# EAGLE design schematic (EAGLE 9.1.1)
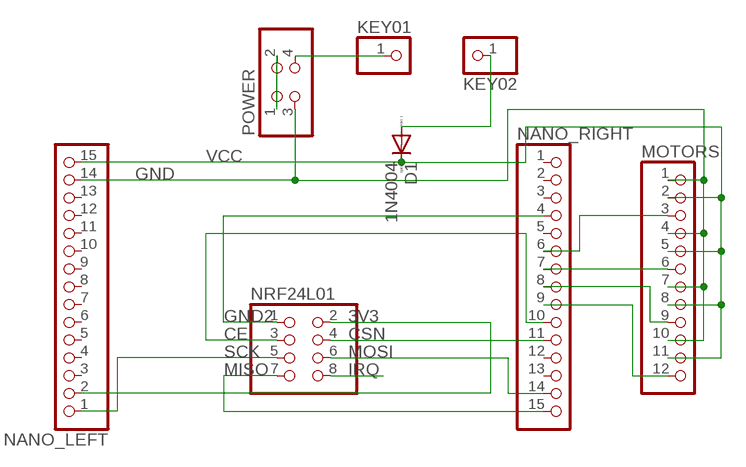
[diagram p0: schematic, sheet 1]

## Parts
D1  1N4004  [DO41-10]
KEY01  PINHD-1X1  [1X01]
KEY02  PINHD-1X1  [1X01]
MOTORS  PINHD-1X12  [1X12]
NANO_LEFT  PINHD-1X15  [1X15]
NANO_RIGHT  PINHD-1X15  [1X15]
NRF24L01  PINHD-2X4  [2X04]
POWER  PINHD-2X2  [2X02]

## Nets
3V3: NANO_LEFT.2 NRF24L01.2
CE: NANO_RIGHT.10 NRF24L01.3
CSN: NANO_RIGHT.11 NRF24L01.4
GND: MOTORS.1 MOTORS.4 MOTORS.7 MOTORS.10 NANO_LEFT.14 POWER.3
GND2: NANO_RIGHT.4 NRF24L01.1
IRQ: NRF24L01.8
MISO: NANO_RIGHT.15 NRF24L01.7
MOSI: NANO_RIGHT.14 NRF24L01.6
N$1: POWER.1 POWER.2
N$2: KEY01.1 POWER.4
N$3: D1.A KEY02.1
N$4: MOTORS.12 NANO_RIGHT.9
N$5: MOTORS.9 NANO_RIGHT.8
N$6: MOTORS.6 NANO_RIGHT.7
N$7: MOTORS.3 NANO_RIGHT.6
SCK: NANO_LEFT.1 NRF24L01.5
VCC: D1.C MOTORS.2 MOTORS.5 MOTORS.8 MOTORS.11 NANO_LEFT.15
Unconnected: NANO_LEFT.3 NANO_LEFT.4 NANO_LEFT.5 NANO_LEFT.6 NANO_LEFT.7 NANO_LEFT.8 NANO_LEFT.9 NANO_LEFT.10 NANO_LEFT.11 NANO_LEFT.12 NANO_LEFT.13 NANO_RIGHT.1 NANO_RIGHT.2 NANO_RIGHT.3 NANO_RIGHT.5 NANO_RIGHT.12 NANO_RIGHT.13

## Library data of the parts
D1 = diode:1N4004: DIODE general purpose rectifier, 1 A
KEY01 KEY02 = pinhead:PINHD-1X1: PIN HEADER
MOTORS = pinhead:PINHD-1X12: PIN HEADER
NANO_LEFT NANO_RIGHT = pinhead:PINHD-1X15: PIN HEADER
NRF24L01 = pinhead:PINHD-2X4: PIN HEADER
POWER = pinhead:PINHD-2X2: PIN HEADER

## Board
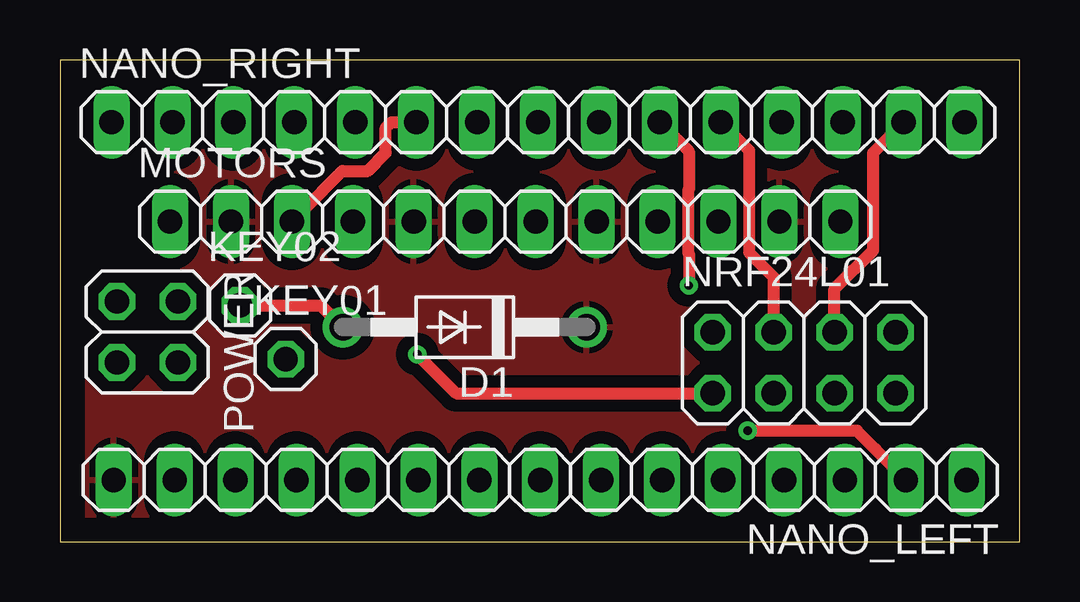
[diagram p1: board, top side]
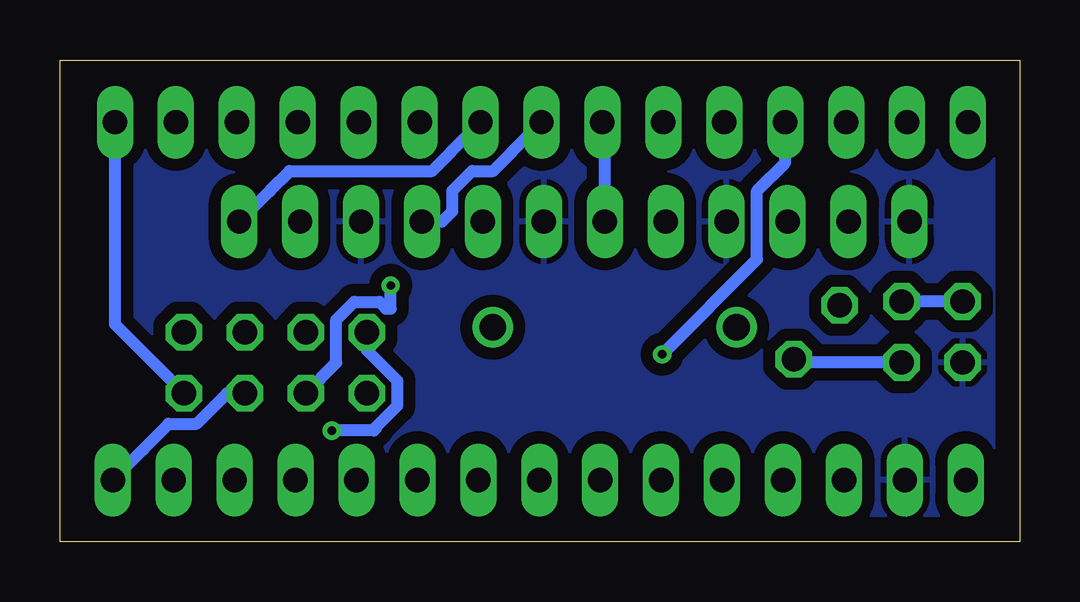
[diagram p2: board, bottom side, seen from below]

Size 40 x 20.09 mm. Coordinates in mm from the lower left corner, seen from the top.
Outline: 0,0 40,0 40,20.09 0,20.09 0,0
Copper layers (1*16): Top 0.035mm / dielectric 1.5mm / Bottom 0.035mm
Design rules "default *": minimum track width 20mil, minimum drill 0.35mm, track to track 20mil, track to pad 10mil, pad to pad 10mil, via to via 20mil, smd to smd 10mil, copper to edge 40mil, drill to drill 6mil, minimum pad ring 10mil, minimum via ring 8mil, stop-mask expansion 4mil, vias tented up to drill 0mil, thermal gap 10mil

### Footprints (pad centres in the part's own frame; a part is rotated, then mirrored left to right if it is on the bottom)
DO41-10 = drill 1.118: A 5.08,0; C -5.08,0
1X01 = drill 1.016 octagon: 1 0,0
1X12 = drill 1.016 long: 1 -13.97,0; 2 -11.43,0; 3 -8.89,0; 4 -6.35,0; 5 -3.81,0; 6 -1.27,0; 7 1.27,0; 8 3.81,0; 9 6.35,0; 10 8.89,0; 11 11.43,0; 12 13.97,0
1X15 = drill 1.016 long: 1 -17.78,0; 2 -15.24,0; 3 -12.7,0; 4 -10.16,0; 5 -7.62,0; 6 -5.08,0; 7 -2.54,0; 8 0,0; 9 2.54,0; 10 5.08,0; 11 7.62,0; 12 10.16,0; 13 12.7,0; 14 15.24,0; 15 17.78,0
2X04 = drill 1.016 octagon: 1 -3.81,-1.27; 2 -3.81,1.27; 3 -1.27,-1.27; 4 -1.27,1.27; 5 1.27,-1.27; 6 1.27,1.27; 7 3.81,-1.27; 8 3.81,1.27
2X02 = drill 1.016 octagon: 1 -1.27,-1.27; 2 -1.27,1.27; 3 1.27,-1.27; 4 1.27,1.27

### Placement (x,y rotation side)
D1  16.88,8.94 180 top
KEY01  9.41,7.61 0 top
KEY02  7.5,9.85 0 top
MOTORS  18.56,13.34 0 top
NANO_LEFT  20.02,2.57 180 top
NANO_RIGHT  19.93,17.49 0 top
NRF24L01  31.02,7.46 0 top
POWER  3.64,8.74 270 top

### Tracks (layer width: path | path; a pad name or v marks a point on that pad's centre or on a via)
3V3  (via drill 0.35)
  Top 0.508: NANO_LEFT.2 33.99,3.84 33.99,3.86 33.22,4.62 v28.66,4.62 v28.66,4.63
  Bottom 0.508: NRF24L01.2 27.21,7.98 25.94,6.71 25.94,5.66 26.83,4.77 26.83,4.72 26.92,4.63 v28.66,4.63
CE  (via drill 0.35)
  Top 0.508: NANO_RIGHT.10 26.21,16.28 26.21,14.67 26.18,14.63 26.18,12.06 26.21,12.02 v26.21,10.68
  Bottom 0.508: v26.21,10.68 26.21,9.72 26.41,9.72 26.68,10 27.74,10 28.48,9.25 28.48,7.46 NRF24L01.3
CSN
  Top 0.508: NRF24L01.4 29.75,11.03 28.72,12.06 28.72,16.32 NANO_RIGHT.11
GND
  pour Bottom: 0,20.08 39.98,20.08 39.98,0 -0.01,0 -0.01,20.08
GND2  (via drill 0.35)
  Top 0.508: v14.89,7.81 16.52,6.19 NRF24L01.1
  Bottom 0.508: v14.89,7.81 10.94,11.76 10.94,14.63 9.77,15.8 NANO_RIGHT.4
MISO
  Bottom 0.508: NRF24L01.7 37.71,9.06 NANO_RIGHT.15
MOSI
  Top 0.508: NANO_RIGHT.14 33.9,16.22 33.9,12.15 32.29,10.55 NRF24L01.6
N$1
  Bottom 0.508: POWER.1 POWER.2
N$2
  Bottom 0.508: POWER.4 9.27,7.47 KEY01.1
N$3
  Top 0.508: KEY02.1 10.89,9.85 D1.A
N$4
  Bottom 0.508: MOTORS.12 31.26,14.61 31.26,14.63 30.43,15.46 24.48,15.46 23.74,16.2 23.74,16.22 NANO_RIGHT.9
N$5
  Bottom 0.508: MOTORS.9 24.07,13.34 23.64,13.78 23.64,14.63 22.82,15.46 21.94,15.46 21.2,16.2 21.2,16.22 NANO_RIGHT.8
N$6
  Bottom 0.508: MOTORS.6 17.29,17.39 NANO_RIGHT.7
N$7
  Top 0.508: NANO_RIGHT.6 13.81,17.49 13.58,17.25 13.58,16.2 12.83,15.46 11.77,15.46 10.94,14.63 10.94,14.61 MOTORS.3
SCK
  Bottom 0.508: NANO_LEFT.1 36.53,3.84 36.53,3.86 35.47,4.92 34.3,4.92 33.03,6.19 NRF24L01.5
VCC
  pour Top: 0.09,20 40.07,20 40.07,0 0.1,0 0.1,19.98